# EAGLE design p2005s-v1_0_squaredboard_singlesided (EAGLE 4.13)
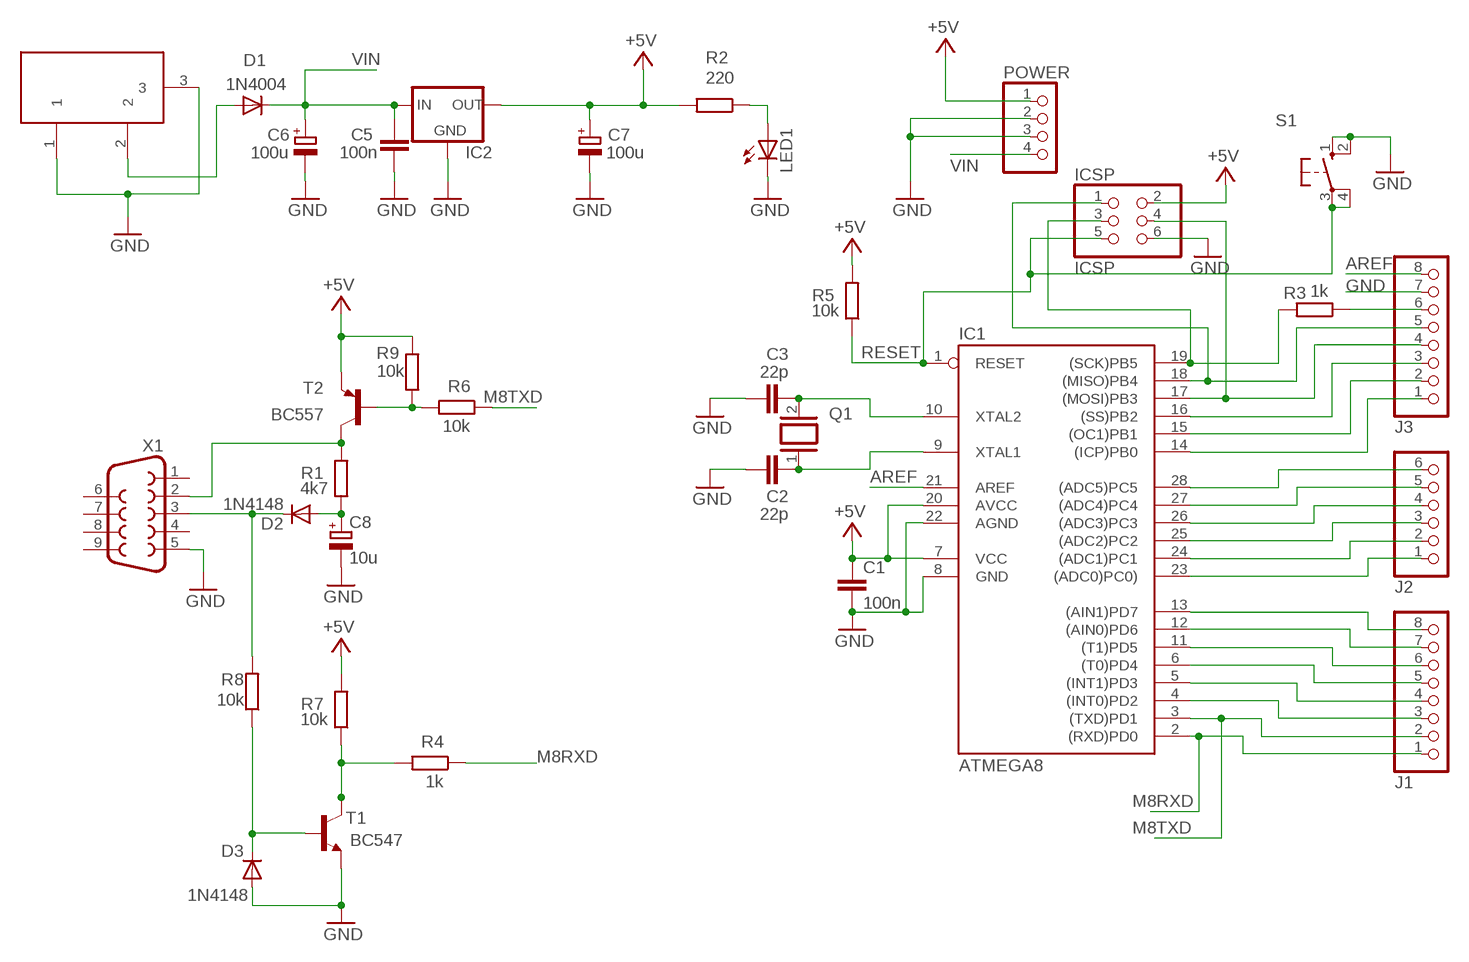
[diagram p0: schematic, sheet 1]

## Parts
C1  100n  C-EU050-025X075  [C050-025X075]
C2  22p  C-EU050-025X075  [C050-025X075]
C3  22p  C-EU050-025X075  [C050-025X075]
C5  100n  C-EU050-025X075  [C050-025X075]
C6  100u  CPOL-EUE3.5-8  [E3,5-8]
C7  100u  CPOL-EUE3.5-8  [E3,5-8]
C8  10u  CPOL-EUE5-6  [E5-6]
D1  1N4004  [DO41-10]
D2  1N4148  [DO35-10]
D3  1N4148  [DO35-10]
DC1  DC21MMX  [DC-21MM]
IC1  ATMEGA8  AT90S4433P  [DIL28-3]
IC2  78MXXS  [78MXXS]
ICSP  ICSP  PINHD-2X3  [2X03]
J1  PINHD-1X8  [1X08]
J2  PINHD-1X6  [1X06]
J3  PINHD-1X8  [1X08]
LED1  LED3MM  [LED3MM]
POWER  PINHD-1X4  [1X04]
Q1  XTAL/S  [QS]
R1  4k7  R-EU_0207/10  [0207/10]
R2  220  R-EU_0207/10  [0207/10]
R3  1k  R-EU_0207/10  [0207/10]
R4  1k  R-EU_0207/10  [0207/10]
R5  10k  R-EU_0207/10  [0207/10]
R6  10k  R-EU_0207/10  [0207/10]
R7  10k  R-EU_0207/10  [0207/10]
R8  10k  R-EU_0207/10  [0207/10]
R9  10k  R-EU_0207/10  [0207/10]
S1  10-XX  [B3F-10XX]
T1  BC547  [TO92]
T2  BC557  BC557B-PNP-TO92-EBC  [TO92-EBC]
X1  F09H  [F09H]

## Nets
+5V [power]: C1.1 C7.+ IC1.7(VCC) IC1.20(AVCC) IC2.OUT ICSP.2 POWER.1 R2.2 R5.2 R7.2 R9.1 T2.E
AREF: IC1.21(AREF) J3.8
GND [power]: C1.2 C2.1 C3.1 C5.1 C6.- C7.- C8.- D3.A DC1.1 DC1.3 IC1.8(GND) IC1.22(AGND) IC2.GND ICSP.6 J3.7 LED1.K(C) POWER.2 POWER.3 S1.1(S) S1.2(S1) T1.1(E) X1.5
M8RXD: IC1.2((RXD)PD0) J1.1 R4.1
M8TXD: IC1.3((TXD)PD1) J1.2 R6.1
N$1: IC1.18((MISO)PB4) ICSP.1 J3.5
N$2: J3.6 R3.1
N$3: LED1.A R2.1
N$4: IC1.17((MOSI)PB3) ICSP.4 J3.4
N$5: IC1.14((ICP)PB0) J3.1
N$6: C2.2 IC1.9(XTAL1) Q1.1
N$7: C3.2 IC1.10(XTAL2) Q1.2
N$8: D1.A DC1.2
N$9: R1.2 T2.C X1.2
N$10: IC1.4((INT0)PD2) J1.3
N$11: IC1.5((INT1)PD3) J1.4
N$12: IC1.6((T0)PD4) J1.5
N$13: IC1.11((T1)PD5) J1.6
N$14: IC1.12((AIN0)PD6) J1.7
N$15: IC1.13((AIN1)PD7) J1.8
N$16: IC1.23((ADC0)PC0)) J2.1
N$17: IC1.24((ADC1)PC1) J2.2
N$18: IC1.25((ADC2)PC2) J2.3
N$19: IC1.26((ADC3)PC3) J2.4
N$20: IC1.27((ADC4)PC4) J2.5
N$21: IC1.28((ADC5)PC5) J2.6
N$22: IC1.15((OC1)PB1) J3.2
N$23: IC1.16((SS)PB2) J3.3
N$24: C8.+ D2.A R1.1
N$25: D2.C R8.2 X1.3
N$26: R4.2 R7.1 T1.3(C)
N$27: R6.2 R9.2 T2.B
N$29: D3.C R8.1 T1.2(B)
RESET: IC1.1(RESET) ICSP.5 R5.1 S1.3(P) S1.4(P1)
SCK: IC1.19((SCK)PB5) ICSP.3 R3.2
VIN [power]: C5.2 C6.+ D1.C IC2.IN POWER.4
Unconnected: X1.1 X1.4 X1.6 X1.7 X1.8 X1.9

## Library data of the parts
C1-C3 C5 = rcl:C-EU: CAPACITOR, European symbol
C6-C8 = rcl:CPOL-EU: POLARIZED CAPACITOR, European symbol
D1 = diode:1N4004: DIODE general purpose rectifier, 1 A
D2 D3 = diode:1N4148: DIODE high speed (Philips)
DC1 = powersupply:DC21MM
IC1 = atmel:AT90S4433: MICROCONTROLLER 4 Kbytes FLASH 128 bytes SRAM 256 bytes EEPROM UART 6-channel 10 bit ADC
IC2 = v-reg:78MXXS: VOLTAGE REGULATOR
ICSP = pinhead:PINHD-2X3: PIN HEADER
J1 J3 = pinhead:PINHD-1X8: PIN HEADER
J2 = pinhead:PINHD-1X6: PIN HEADER
LED1 = led:LED: LED OSRAM: - CHIPLED LG R971, LG N971, LY N971, LG Q971, LY Q971, LO R971, LY R971 LH N974, LH R974 LS Q976, LO Q976, LY Q976 LO Q996 - Hyper CHIPLED LW Q18S LB Q993, LB Q99A, LB R99A - SideLED LS A670, LO A670, LY A670, LG A670, LP A670 LB A673, LV A673, LT A673, LW A673 LH A674 LY A675 LS A676, LA A676, LO A676, LY A676, LW A676 LS A679, LY A679, LG A679 - Hyper Micro SIDELED® LS Y876, LA Y876, LO Y876, LY Y876 LT Y87S - SmartLED LW L88C, LW L88S LB L89C, LB L89S, LG L890 LS L89K, LO L89K, LY L89K LS L896, LA L896, LO L896, LY L896 - TOPLED LS T670, LO T670, LY T670, LG T670, LP T670 LSG T670, LSP T670, LSY T670, LOP T670, LYG T670 LG T671, LOG T671, LSG T671 LB T673, LV T673, LT T673, LW T673 LH T674 LS T676, LA T676, LO T676, LY T676, LB T676, LH T676, LSB T676, LW T676 LB T67C, LV T67C, LT T67C, LS T67K, LO T67K, LY T67K, LW E67C LS E67B, LA E67B, LO E67B, LY E67B, LB E67C, LV E67C, LT E67C LW T67C LS T679, LY T679, LG T679 LS T770, LO T770, LY T770, LG T770, LP T770 LB T773, LV T773, LT T773, LW T773 LH T774 LS E675, LA E675, LY E675, LS T675 LS T776, LA T776, LO T776, LY T776, LB T776 LHGB T686 LT T68C, LB T68C - Hyper Mini TOPLED® LB M676 - Mini TOPLED Santana® LG M470 LS M47K, LO M47K, LY M47K Source: http://www.osram.convergy.de/
POWER = pinhead:PINHD-1X4: PIN HEADER
Q1 = special:XTAL/S: CRYSTAL
R1-R9 = rcl:R-EU_: RESISTOR, European symbol
S1 = switch-omron:10-XX: OMRON SWITCH
T1 = transistor:BC547: NPN TRANSISTOR
T2 = transistor:*-PNP-: PNP Transistror
X1 = con-subd:F09: SUB-D

## Net classes
1 power: width 0.61 mm

## Board
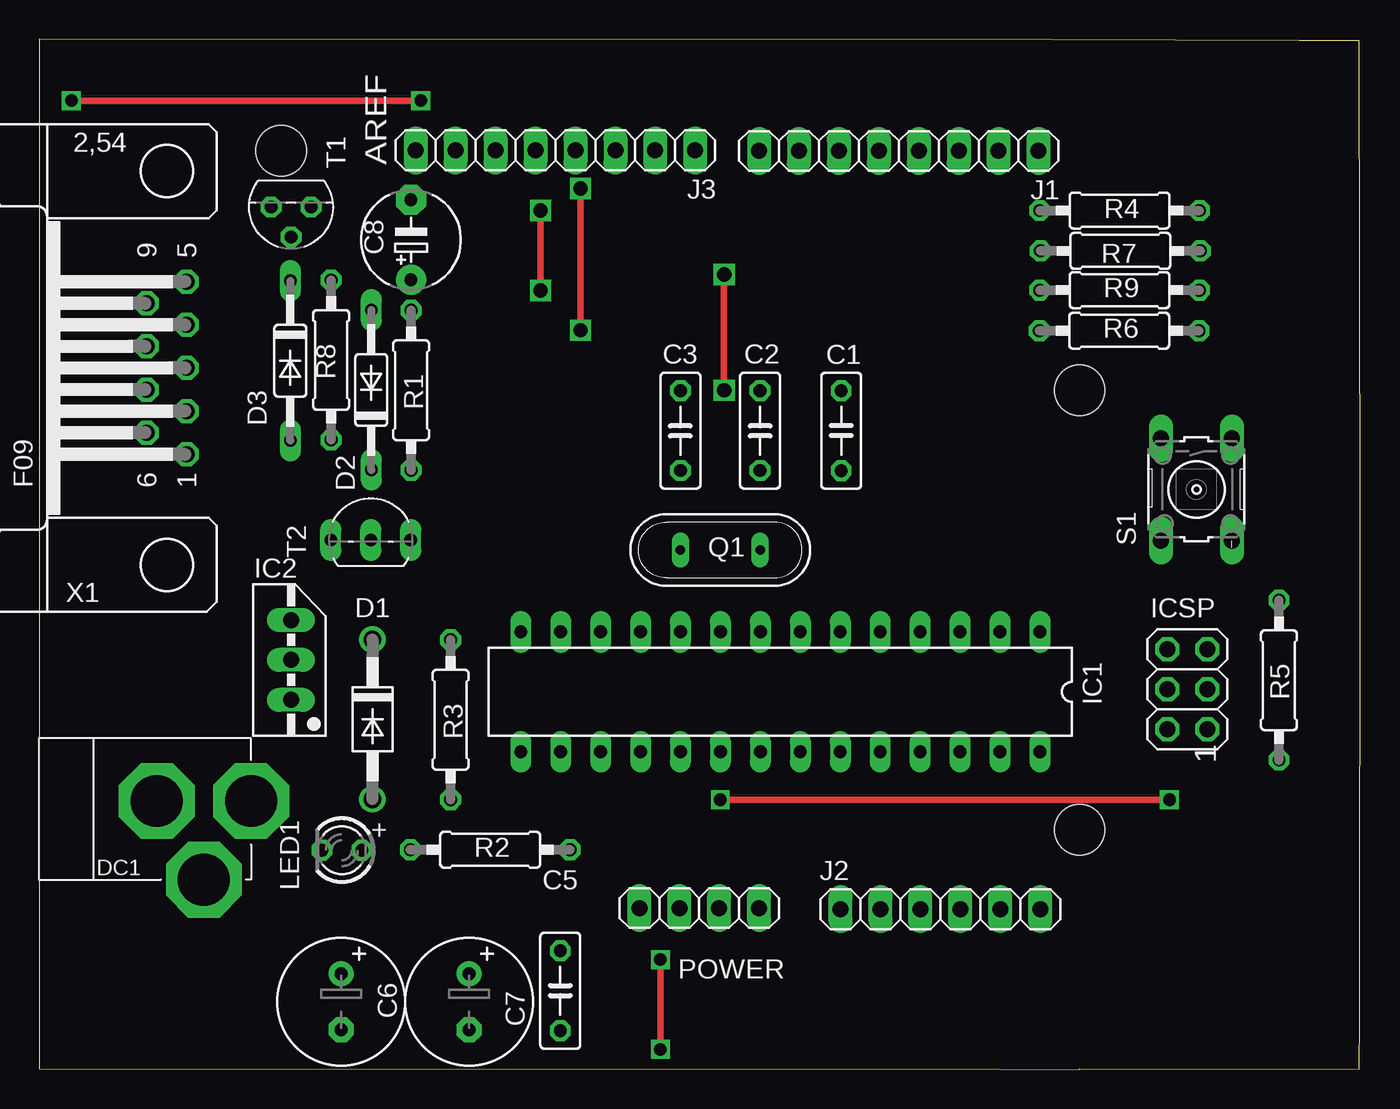
[diagram p1: board, top side]
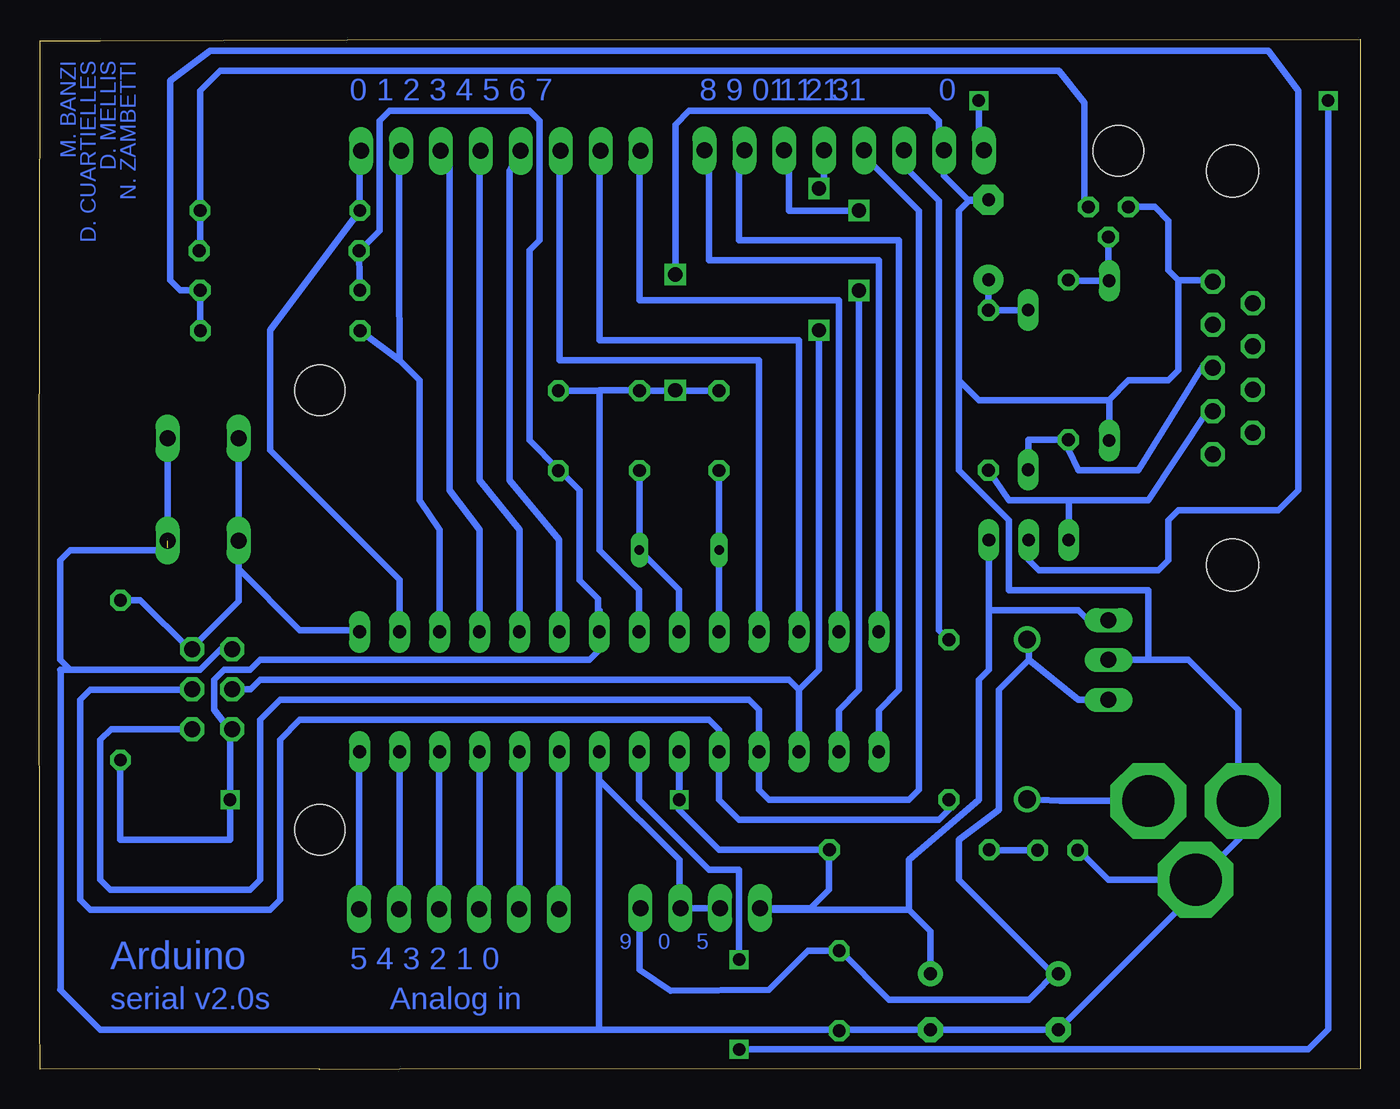
[diagram p2: board, bottom side, seen from below]

Size 84.01 x 65.51 mm. Coordinates in mm from the lower left corner, seen from the top.
Outline: 0,65.51 0,0.05 61.09,0.01 66.19,0 66.19,0.05 83.95,0.01 83.99,3.2 84.01,35.46 83.95,65.43 80.14,65.43 64.44,65.47 0,65.51
Copper layers (1*16): Top 0.035mm / dielectric 1.5mm / Bottom 0.035mm
Design rules "default": minimum track width 10mil, minimum drill 24mil, track to track 8mil, track to pad 8mil, pad to pad 8mil, via to via 8mil, smd to smd 8mil, copper to edge 40mil, drill to drill 8mil, minimum pad ring 10mil, minimum via ring 8mil, stop-mask expansion 4mil, vias tented up to drill 0mil, thermal gap 10mil
Holes 3.2 mm at 66.17,43.19 66.17,15.25 15.37,58.43

### Footprints (pad centres in the part's own frame; a part is rotated, then mirrored left to right if it is on the bottom)
C050-025X075 = drill 0.813 octagon: 1 -2.54,0; 2 2.54,0
E3,5-8 = drill 0.813 pad 1.6 round: + -1.778,0 | drill 0.813 pad 1.6 octagon: - 1.778,0
E5-6 = drill 0.813 pad 1.905 round: + -2.54,0 | drill 0.813 pad 1.905 octagon: - 2.54,0
DO41-10 = drill 1.118 round: A 5.08,0; C -5.08,0
DO35-10 = drill 0.813 long: A 5.08,0; C -5.08,0
DC-21MM = drill 3.302 pad 4.826 octagon: 1 -5.08,-3.353; 2 -0.076,-6.35; 3 -0.076,-0.356
DIL28-3 = drill 0.813 long: 1 -16.51,-3.81; 2 -13.97,-3.81; 3 -11.43,-3.81; 4 -8.89,-3.81; 5 -6.35,-3.81; 6 -3.81,-3.81; 7 -1.27,-3.81; 8 1.27,-3.81; 9 3.81,-3.81; 10 6.35,-3.81; 11 8.89,-3.81; 12 11.43,-3.81; 13 13.97,-3.81; 14 16.51,-3.81; 15 16.51,3.81; 16 13.97,3.81; 17 11.43,3.81; 18 8.89,3.81; 19 6.35,3.81; 20 3.81,3.81; 21 1.27,3.81; 22 -1.27,3.81; 23 -3.81,3.81; 24 -6.35,3.81; 25 -8.89,3.81; 26 -11.43,3.81; 27 -13.97,3.81; 28 -16.51,3.81
78MXXS = drill 1.016 long: GND 0,-2.54; IN -2.54,-2.54; OUT 2.54,-2.54
2X03 = drill 1.016 octagon: 1 -2.54,-1.27; 2 -2.54,1.27; 3 0,-1.27; 4 0,1.27; 5 2.54,-1.27; 6 2.54,1.27
1X08 = drill 1.016 long: 1 -8.89,0; 2 -6.35,0; 3 -3.81,0; 4 -1.27,0; 5 1.27,0; 6 3.81,0; 7 6.35,0; 8 8.89,0
1X06 = drill 1.016 long: 1 -6.35,0; 2 -3.81,0; 3 -1.27,0; 4 1.27,0; 5 3.81,0; 6 6.35,0
LED3MM = drill 0.813 octagon: A -1.27,0; K 1.27,0
1X04 = drill 1.016 long: 1 -3.81,0; 2 -1.27,0; 3 1.27,0; 4 3.81,0
QS = drill 0.61 long: 1 -2.54,0; 2 2.54,0
0207/10 = drill 0.813 octagon: 1 -5.08,0; 2 5.08,0
B3F-10XX = drill 1.016 long: 1 -3.251,2.261; 2 3.251,2.261; 3 -3.251,-2.261; 4 3.251,-2.261
TO92 = drill 0.813 octagon: 1 1.27,0; 2 0,1.905; 3 -1.27,0
TO92-EBC = drill 0.813 long: B 0,-1.27; C -2.54,-1.27; E 2.54,-1.27
F09H = drill 1.016 octagon: 1 -5.486,-1.27; 2 -2.743,-1.27; 3 0,-1.27; 4 2.743,-1.27; 5 5.486,-1.27; 6 -4.115,1.27; 7 -1.372,1.27; 8 1.372,1.27; 9 4.115,1.27 | hole 3.302: -12.522,0; 12.522,0

### Placement (x,y rotation side)
C1  51,40.62 90 top
C2  45.84,40.63 270 top
C3  40.78,40.63 270 top
C5  33.14,5.01 90 top
C6  19.2,4.32 270 top
C7  27.33,4.31 270 top
C8  23.64,52.76 90 top
D1  21.19,22.27 270 top
D2  21.11,43.21 90 top
D3  15.97,45.07 270 top
DC1  7.12,17.16 90 top
IC1  47.13,24.02 180 top
IC2  13.47,26.05 90 top
ICSP  73.02,24.19 90 top
J1  54.67,58.41 180 top
J2  57.31,10.2 0 top
J3  32.83,58.45 180 top
LED1  19.24,13.95 180 top
POWER  41.97,10.27 0 top
Q1  43.31,33.04 180 top
R1  23.65,43.2 270 top
R2  28.68,13.98 0 top
R3  26.16,22.24 270 top
R4  68.71,54.62 0 top
R5  78.85,24.76 270 top
R6  68.69,46.98 0 top
R7  68.76,52.06 180 top
R8  18.56,45.12 270 top
R9  68.71,49.56 0 top
S1  73.6,36.89 270 top
T1  16.01,54.85 180 top
T2  21.08,34.94 0 top
X1  8.11,44.61 90 top

### Tracks (layer width: path | path; a pad name or v marks a point on that pad's centre or on a via)
+5V  (via drill 0.8)
  Top 0.406: v43.31,17.16 v71.88,17.16
  Bottom 0.406: R5.2 78.87,14.62 71.88,14.62 v71.88,17.16 71.88,21.6 71.83,21.65 ICSP.2 71.94,21.65 72.9,22.87 72.9,24.78 72.27,25.41 70.61,25.41 69.98,26.05 49.03,26.05 48.39,26.68 48.39,27.95 48.4,27.94 IC1.7 48.4,29.21 48.39,29.22 48.46,29.22 | IC2.OUT 17.27,28.59 17.91,29.22 23.62,29.22 | 23.62,29.22 23.62,33.03 T2.E | 33.79,13.98 40.77,13.98 43.32,16.53 IC1.20 v43.31,17.16 | C7.+ 27.33,8.8 28.7,10.17 | 28.7,10.17 38.23,10.17 38.16,10.24 POWER.1 34.95,10.27 33.79,11.44 33.79,13.98 | 33.79,13.98 33.78,13.98 R2.2 | R9.1 63.63,50.17 63.63,50.18 63.66,50.15 R7.2 63.66,52.06 62.36,53.35 62.36,60.34 61.73,60.97 52.84,60.97 52.2,60.34 52.2,52.72 52.84,52.08 52.84,40.02 51,38.18 C1.1 50.96,38.08 50.93,38.11 49.66,36.84 49.66,31.13 48.46,29.93 48.46,29.22 | 28.7,10.17 28.7,13.35 24.26,17.16 24.26,24.78 23.62,25.41 23.62,29.22 | 48.46,29.22 48.46,29.01
AREF  (via drill 0.8)
  Top 0.406: v39.5,1.28 v39.5,7 | v2.04,61.61 v24.26,61.61
  Bottom 0.406: IC1.21 45.86,17.17 41.41,12.71 39.5,12.71 v39.5,7 | v39.5,1.28 3.3,1.28 2.04,2.55 v2.04,61.61 | 24.28,58.45 23.62,58.43 | 24.28,58.45 J3.8 | v24.26,61.61 24.26,59.07 24.28,58.45
GND  (via drill 0.9 pad 1.02)  (1 unrouted)
  Top 0.406: v43.56,50.56 v43.56,43.19
  Bottom 0.406: 43.31,10.17 43.31,13.35 48.4,18.44 IC1.22 48.4,2.56 48.39,2.55 48.39,2.54 | 43.31,10.17 43.25,10.24 POWER.3 | POWER.2 43.21,10.27 43.31,10.17 | 10.29,12.08 7.47,14.89 DC1.3 7.67,17.08 7.75,17.16 7.75,22.87 10.93,26.05 13.47,26.05 | 33.14,2.54 | 33.14,2.54 C5.1 | 33.14,2.54 C6.- 27.45,2.54 27.43,2.55 27.42,2.53 C7.- 19.16,2.53 19.18,2.55 10.29,11.44 10.29,12.08 | 33.14,2.54 33.15,2.55 | LED1.K 17.94,13.95 17.91,13.98 16,12.08 DC1.1 10.29,12.08 | 33.14,2.54 48.39,2.54 | 48.39,2.54 80.12,2.54 82.68,5.09 82.65,5.12 82.65,25.38 82.68,25.41 82.05,25.41 | ICSP.6 72.47,26.73 73.79,25.41 82.05,25.41 | IC1.8 45.86,30.5 48.39,33.03 48.39,43.19 | 48.39,43.19 45.85,43.19 45.84,43.18 C2.1 43.34,43.17 43.31,43.19 | C1.2 48.42,43.16 48.39,43.19 | C3.1 43.29,43.17 43.31,43.19 | v43.56,43.19 43.31,43.19 | v43.56,50.56 43.56,60.08 42.68,60.97 27.43,60.97 26.8,60.34 26.8,58.43 26.78,58.45 J3.7 26.47,56.84 24.89,55.26 | 24.89,55.26 23.62,55.26 23.64,55.27 C8.- 24.85,55.3 24.89,55.26 | T1.1 13.06,54.85 12.2,53.99 12.2,50.81 11.56,50.18 | X1.5 9.58,50.1 9.66,50.18 11.56,50.18 | 15.97,42.56 D3.A | 15.97,42.56 15.97,42.59 14.74,43.83 12.2,43.83 11.56,44.46 11.56,50.18 | 24.89,55.26 25.53,54.62 25.53,43.83 | 25.53,43.83 24.26,42.56 15.97,42.56 | 13.47,26.05 IC2.GND | 13.47,26.05 13.47,30.49 22.36,30.49 22.36,34.94 25.53,38.11 25.53,43.83 | S1.1 75.86,33.19 75.69,33.03 82.05,33.03 82.68,32.4 82.68,26.05 82.05,25.41
M8RXD
  Bottom 0.406: IC1.2 61.1,31.14 69.34,39.38 69.34,47 R4.1 63.63,58.43 63.61,58.41 J1.1
M8TXD
  Bottom 0.406: IC1.3 58.56,34.31 59.82,36.21 59.82,43.83 61.09,45.1 | R6.1 61.11,45.12 61.09,45.1 | J1.2 61.07,58.41 61.09,58.43 61.12,58.15 61.12,50.58 61.09,45.1
N$1
  Bottom 0.406: J3.5 31.23,58.45 31.24,58.43 31.24,57.8 28.07,54.62 28.07,17.79 28.7,17.16 37.6,17.16 38.24,17.8 IC1.18 38.24,22.88 38.87,23.51 68.71,23.51 69.98,22.24 69.98,12.08 70.61,11.44 79.5,11.44 80.14,12.08 80.14,20.97 79.45,21.65 ICSP.1
N$2
  Bottom 0.406: R3.1 26.79,27.94 26.8,55.26 28.7,57.16 28.72,58.45 J3.6
N$3
  Bottom 0.406: 23.62,13.98 | 23.62,13.98 R2.1 | LED1.A 23.59,13.95 23.62,13.98
N$4  (via drill 0.9 pad 1.02)
  Top 0.406: v34.42,47 v34.42,56.02
  Bottom 0.406: IC1.17 35.7,24.15 | 35.7,24.15 36.33,24.78 69.98,24.78 70.56,24.19 | 70.56,24.19 71.88,24.14 | 70.56,24.19 ICSP.4 | J3.4 34.1,56.34 v34.42,56.02 | 35.7,24.15 35.69,24.14 34.42,25.41 v34.42,47
N$5
  Bottom 0.406: IC1.14 30.62,48.26 30.61,51.45 41.41,51.45 41.41,58.43 42.02,58.45 J3.1
N$6
  Bottom 0.406: IC1.9 43.32,30.5 Q1.1 45.85,38.11 45.84,38.1 C2.2
N$7
  Bottom 0.406: Q1.2 | Q1.2 40.77,27.95 40.78,27.94 IC1.10 | C3.2 40.78,33.04 Q1.2
N$8
  Bottom 0.406: D1.A 21.12,17.19 19.1,17.08 DC1.2
N$9
  Bottom 0.406: R1.2 22.36,36.2 18.54,36.21 | 18.54,36.21 T2.C | X1.2 9.71,41.87 13.47,36.21 14.1,36.21 18.54,36.21
N$10
  Bottom 0.406: IC1.4 56.02,34.31 57.91,36.84 57.91,58.43 58.53,58.41 J1.3
N$11
  Bottom 0.406: IC1.5 53.48,34.31 56.01,37.48 56.01,58.43 55.99,58.41 J1.4
N$12
  Bottom 0.406: IC1.6 50.94,33.68 54.11,37.48 54.11,57.16 53.45,58.41 J1.5
N$13
  Bottom 0.406: IC1.11 38.24,29.21 38.23,31.13 38.23,45.1 50.93,45.1 50.93,58.43 50.91,58.41 J1.6
N$14
  Bottom 0.406: IC1.12 35.7,30.48 35.69,46.37 48.39,46.37 48.39,58.43 48.37,58.41 J1.7
N$15
  Bottom 0.406: IC1.13 33.16,29.84 33.15,48.91 45.85,48.91 45.85,58.43 45.83,58.41 J1.8
N$16
  Bottom 0.406: 50.94,10.18 J2.1 | 50.94,10.18 IC1.23 | 50.94,10.18 50.93,10.17
N$17
  Bottom 0.406: 53.48,10.18 J2.2 | 53.48,10.18 IC1.24 | 53.48,10.18 53.47,10.17
N$18
  Bottom 0.406: 56.02,10.18 J2.3 | 56.02,10.18 IC1.25 | 56.02,10.18 56.01,10.17
N$19
  Bottom 0.406: J2.4 58.58,19.67 58.55,19.7 58.55,20.33 58.56,20.32 IC1.26
N$20
  Bottom 0.406: 61.1,10.18 J2.5 | 61.1,10.18 IC1.27 | 61.1,10.18 61.09,10.17
N$21
  Bottom 0.406: 63.64,20.32 63.63,20.33 | 63.64,20.32 IC1.28 | J2.6 63.66,20.3 63.64,20.32
N$22
  Bottom 0.406: IC1.15 30.62,22.86 29.34,24.14 29.34,52.72 39.5,52.72 39.5,58.43 38.88,58.45 J3.2
N$23  (via drill 0.9 pad 1.02)
  Top 0.406: v31.88,49.54 v31.88,54.62
  Bottom 0.406: IC1.16 33.16,22.86 31.88,24.14 v31.88,49.54 | v31.88,54.62 36.33,54.62 36.33,58.43 36.34,58.45 J3.3
N$24
  Bottom 0.406: D2.A 23.6,48.29 23.62,48.27 23.63,48.27 R1.1 23.65,50.15 23.62,50.18 23.64,50.19 C8.+
N$25
  Bottom 0.406: D2.C 21.11,40.04 21.08,40.02 21.06,40.04 R8.2 18.54,40.02 18.54,39.38 17.91,38.11 14.1,38.11 10.02,44.74 X1.3
N$26
  Bottom 0.406: T1.3 17.54,54.87 17.53,61.48 19.18,63.51 72.52,63.51 73.79,62.24 R4.2 73.79,52.08 73.81,52.06 R7.1
N$27
  Bottom 0.406: T2.B 21.08,32.4 20.45,31.76 16,31.76 12.83,31.76 12.2,32.4 12.2,34.94 11.56,35.57 5.21,35.57 3.94,36.84 3.94,62.24 5.84,64.78 73.16,64.78 75.69,62.88 75.69,50.18 75.06,49.54 73.79,49.54 R9.2 73.79,47 R6.2
N$29
  Bottom 0.406: 18.56,50.16 R8.1 18.52,50.15 D3.C 15.98,50.15 16.01,50.18 T1.2
RESET
  Bottom 0.406: R5.1 77.58,29.84 74.42,26.68 | S1.4 71.34,31.85 67.44,27.95 63.63,27.95 63.64,27.94 IC1.1 | 74.42,26.68 74.38,26.73 ICSP.5 | S1.4 71.34,29.77 74.42,26.68 | S1.4 71.28,33.64 71.25,33.67 71.34,33.75 S1.3
SCK
  Bottom 0.406: R3.2 26.16,16.53 26.8,15.89 39.5,15.89 40.77,17.16 40.77,20.33 40.78,20.32 IC1.19 40.78,21.61 41.41,22.24 67.44,22.24 68.71,20.97 68.71,10.81 69.34,10.17 80.77,10.17 81.41,10.81 81.41,23.51 80.77,24.14 74.42,24.14 74.38,24.19 ICSP.3
VIN
  Bottom 0.406: 33.14,7.62 33.15,7.63 | 33.14,7.62 C5.2 35.13,7.55 37.6,5.09 43.87,5.01 45.85,6.36 45.85,10.17 45.79,10.24 POWER.4 | IC2.IN 17.91,23.51 21.08,26.05 | D1.C 21.12,26.72 21.08,27.32 21.08,26.05 | 33.14,7.62 29.97,4.46 21.08,4.46 19.2,6.34 | 19.2,6.34 19.18,6.36 | 19.2,6.34 C6.+ 19.55,6.09 25.53,12.08 25.53,14.62 22.99,16.52 22.99,24.14 21.08,26.05

### Text on the board
Bottom: N. ZAMBETTI | D. MELLIS | D. CUARTIELLES | M. BANZI | 0 | 1 1 1 1 | 8 9 0 1 2 3 | 0 1 2 3 4 5 6 7 | 9 0 5 | 5 4 3 2 1 0 | Arduino | Analog in | serial v2.0s
tNames: AREF | 1 | +